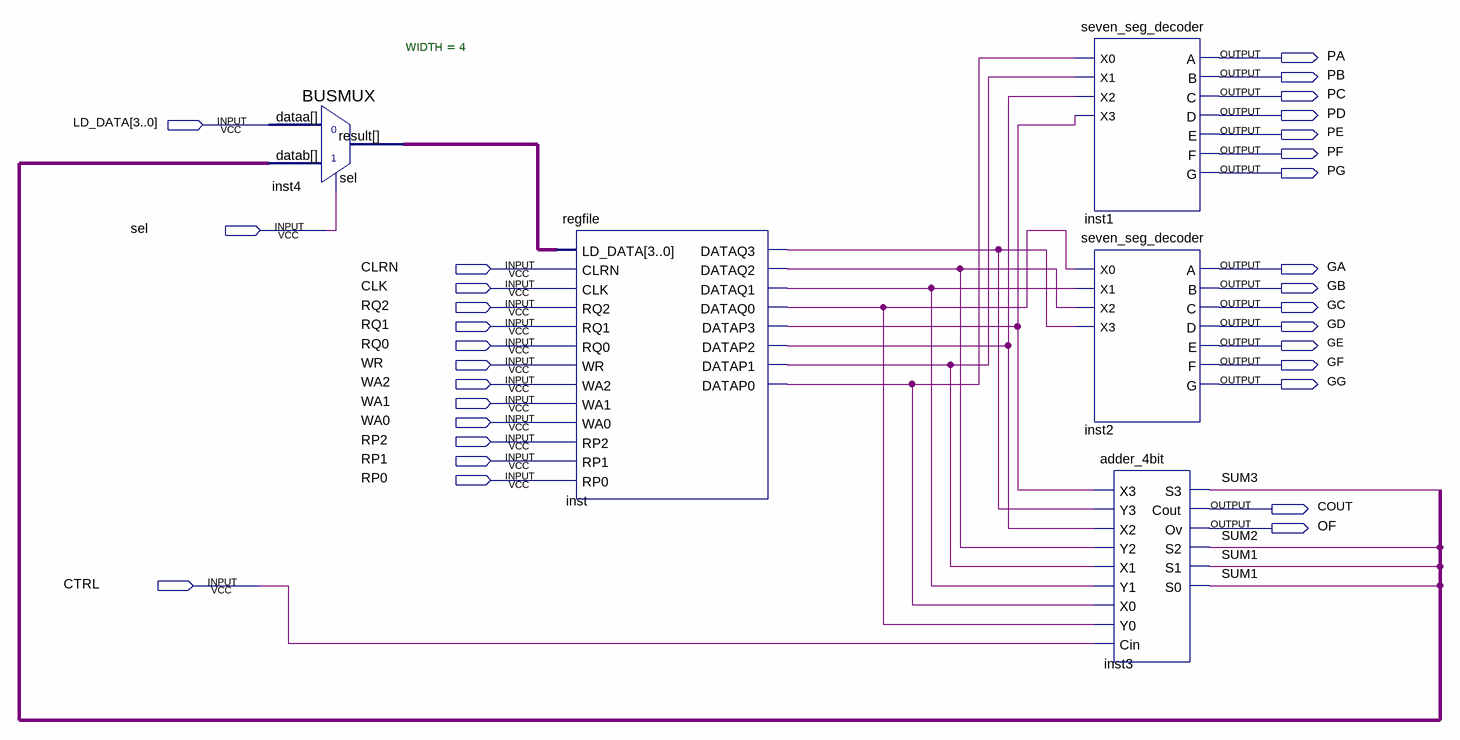
[diagram p0: schematic sheet]
// Quartus schematic seven.bdf as structural Verilog: 5 symbols, 31 pins
module seven (
  input  [3:0] LD_DATA,
  input  sel,
  input  CLRN,
  input  CLK,
  input  RQ2,
  input  RQ1,
  input  RQ0,
  input  WR,
  input  WA2,
  input  WA1,
  input  WA0,
  input  RP2,
  input  RP1,
  input  RP0,
  input  CTRL,
  output PA,
  output PB,
  output PC,
  output PD,
  output PE,
  output PF,
  output PG,
  output GA,
  output GB,
  output GC,
  output GD,
  output GE,
  output GF,
  output GG,
  output COUT,
  output OF
);

  wire inst_datap0, inst_datap1, inst_datap2, inst_datap3, inst_dataq0, inst_dataq1, inst_dataq2,
       inst_dataq3, SUM1, SUM2, SUM3;
  wire [3:0] inst4_result, undriven;

  BUSMUX #(.WIDTH(4)) inst4 (.datab(undriven), .sel(sel), .dataa(LD_DATA), .result(inst4_result));
  regfile inst (
    .LD_DATA(inst4_result), .CLRN(CLRN), .CLK(CLK), .RQ2(RQ2), .RQ1(RQ1), .RQ0(RQ0), .WR(WR), .WA2(WA2),
    .WA1(WA1), .WA0(WA0), .RP2(RP2), .RP1(RP1), .RP0(RP0), .DATAQ3(inst_dataq3), .DATAQ2(inst_dataq2),
    .DATAQ1(inst_dataq1), .DATAQ0(inst_dataq0), .DATAP3(inst_datap3), .DATAP2(inst_datap2),
    .DATAP1(inst_datap1), .DATAP0(inst_datap0));
  seven_seg_decoder inst1 (
    .X0(inst_datap0), .X1(inst_datap1), .X2(inst_datap2), .X3(inst_datap3), .A(PA), .B(PB), .C(PC), .D(PD),
    .E(PE), .F(PF), .G(PG));
  seven_seg_decoder inst2 (
    .X0(inst_dataq0), .X1(inst_dataq1), .X2(inst_dataq2), .X3(inst_dataq3), .A(GA), .B(GB), .C(GC), .D(GD),
    .E(GE), .F(GF), .G(GG));
  adder_4bit inst3 (
    .X3(inst_datap3), .Y3(inst_dataq3), .X2(inst_datap2), .Y2(inst_dataq2), .X1(inst_datap1),
    .Y1(inst_dataq1), .X0(inst_datap0), .Y0(inst_dataq0), .Cin(CTRL), .S3(SUM3), .Cout(COUT), .Ov(OF),
    .S2(SUM2), .S1(SUM1), .S0(SUM1));
endmodule
